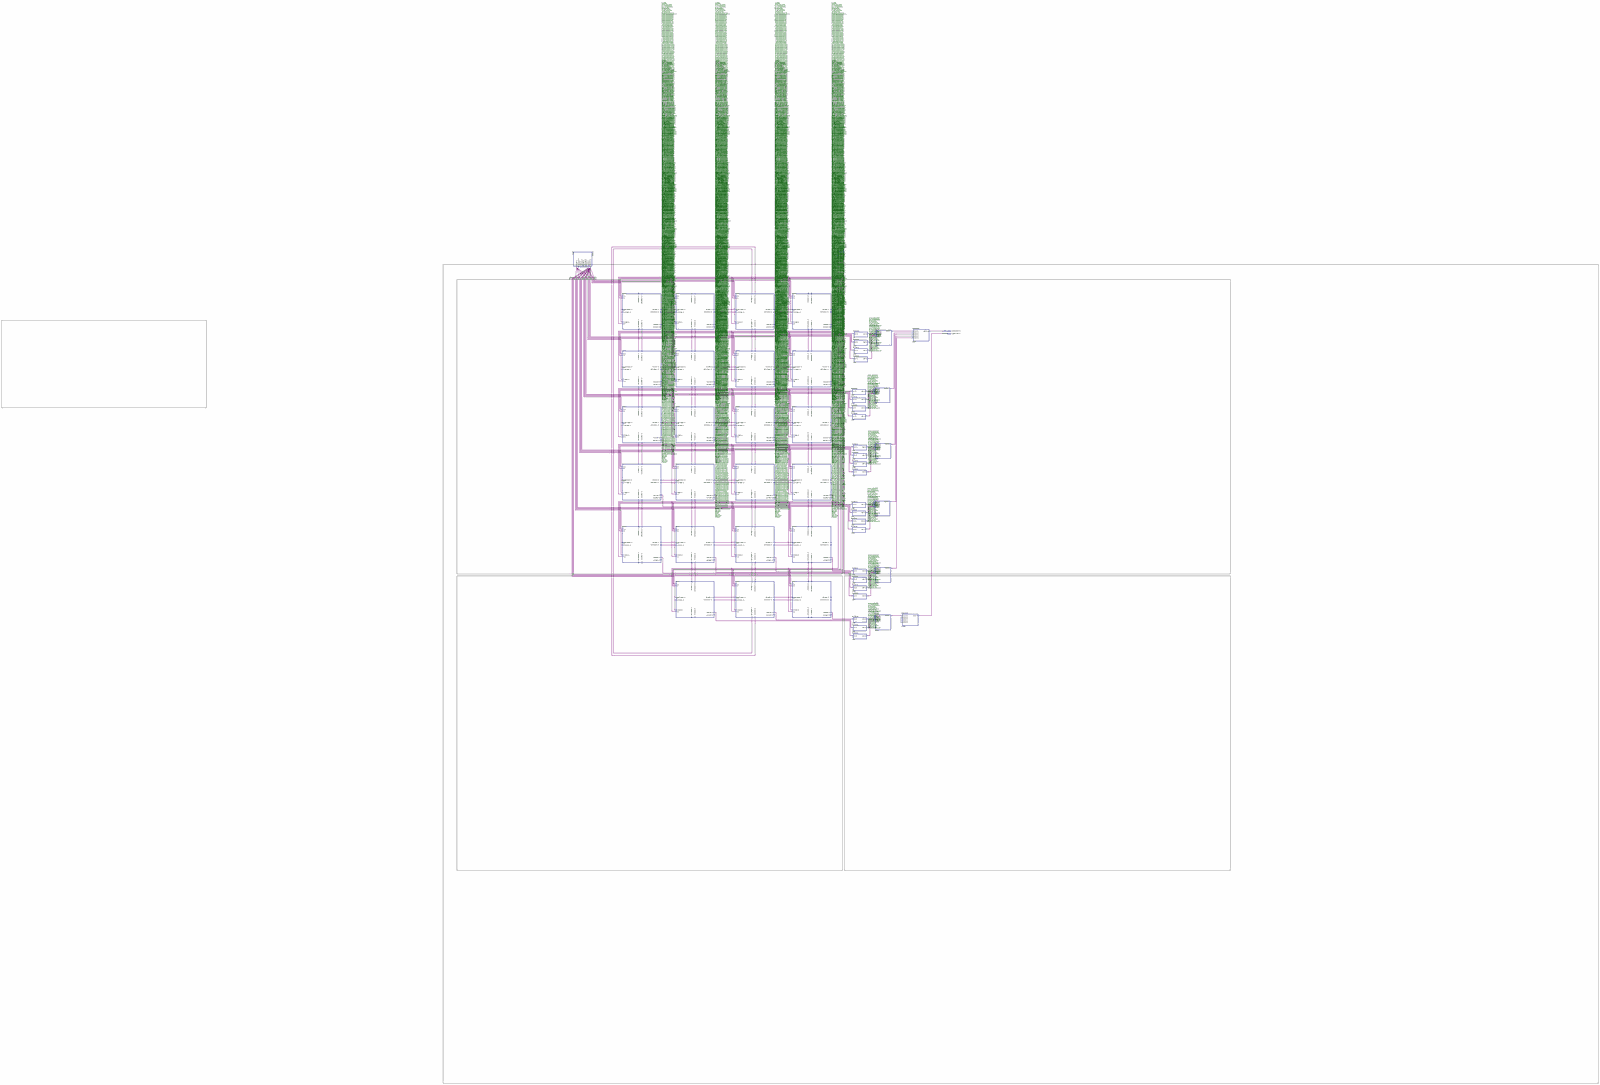
[diagram p0: schematic sheet, whole]
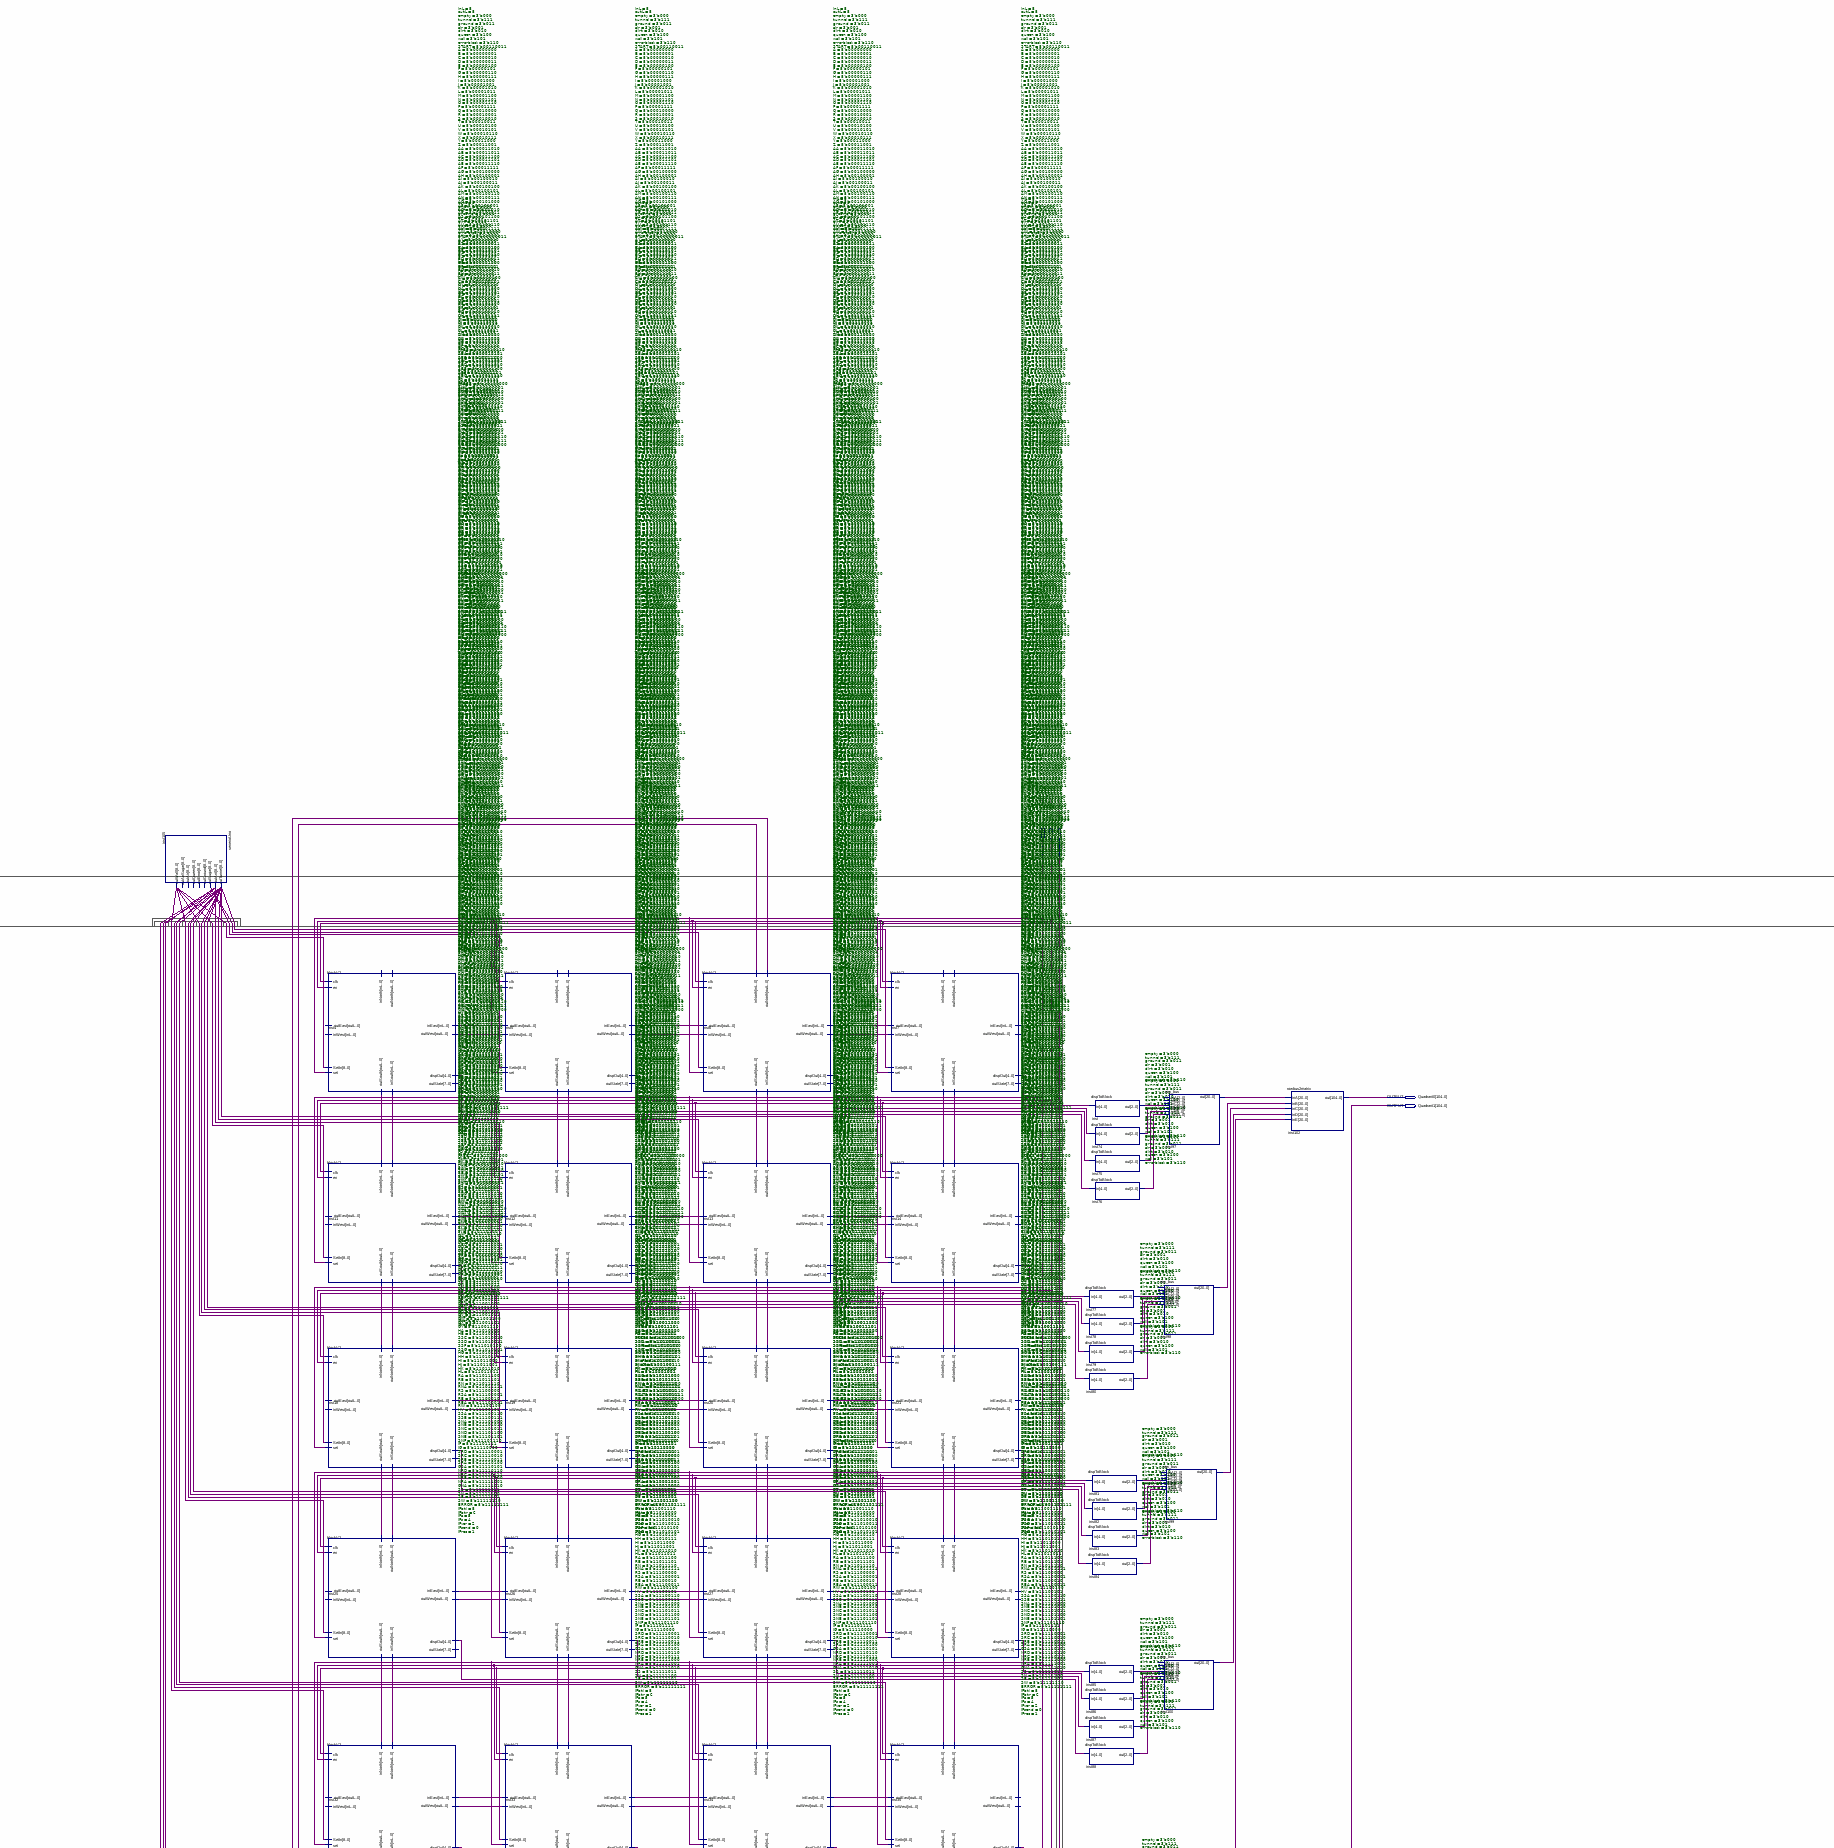
[diagram p1: schematic sheet, upper centre part]
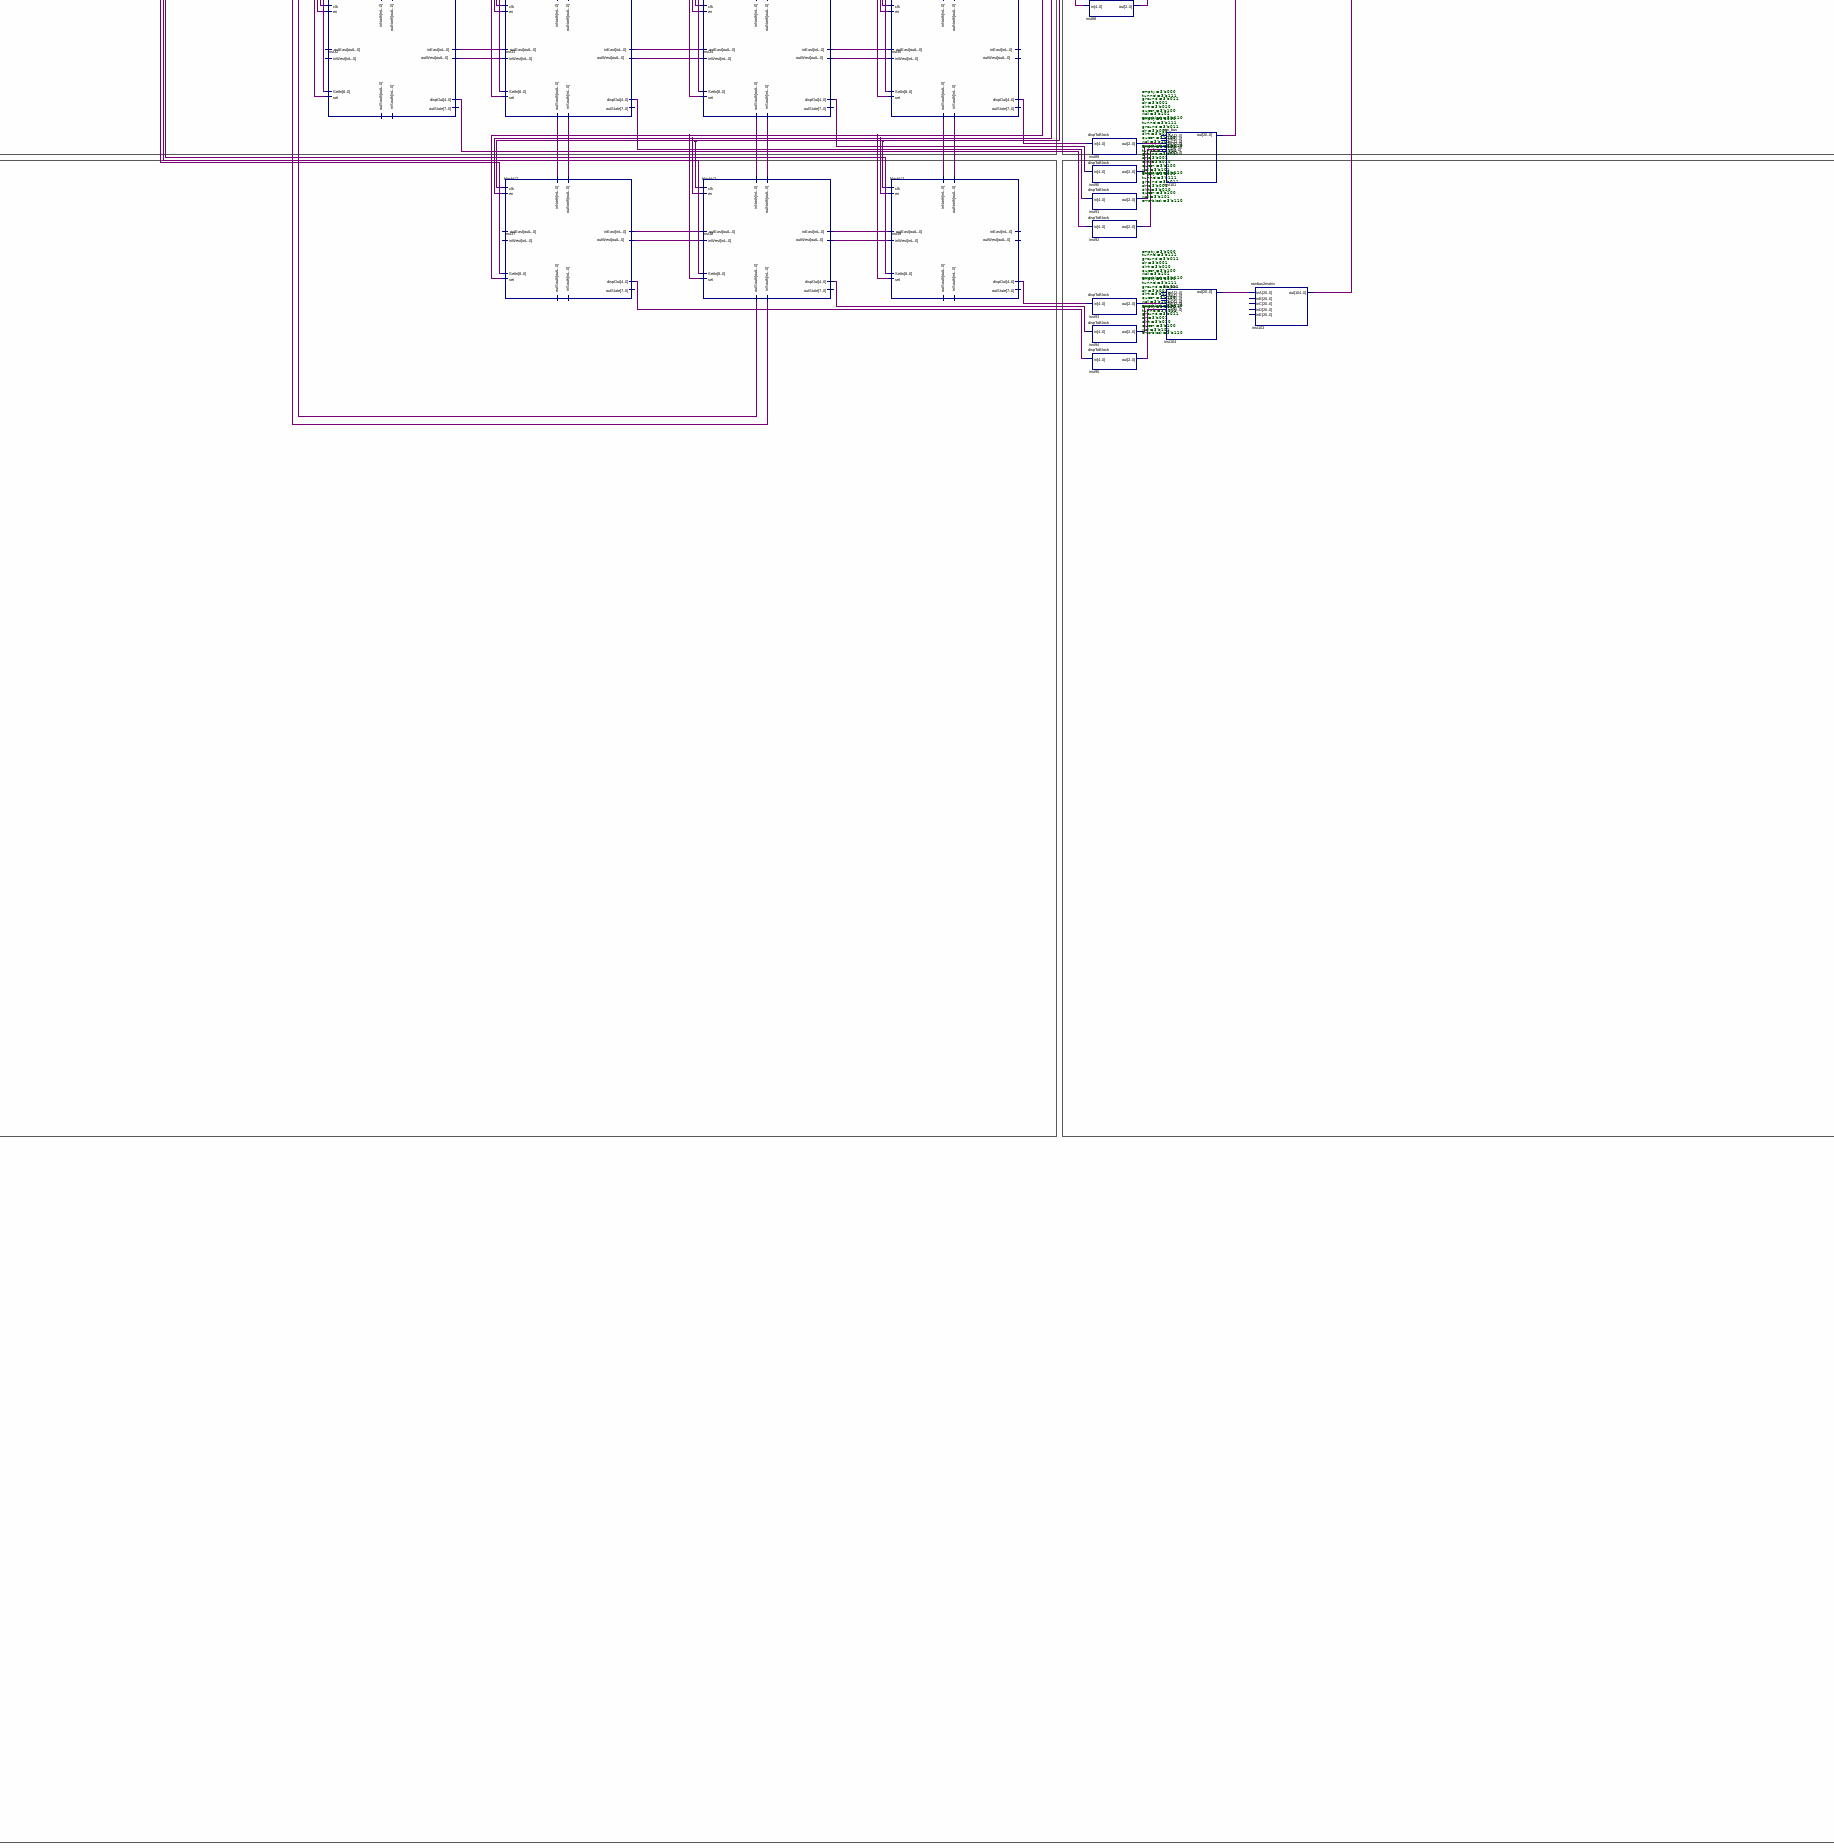
[diagram p2: schematic sheet, lower centre part]
// Quartus schematic EnterTheMAtrix.bdf as structural Verilog: 55 symbols, 5 pins
module EnterTheMAtrix (
  input  set,
  input  enable,
  input  clock_block,
  output [104:0] Quadrant0,
  output [104:0] Quadrant1
);

  wire [2:0] inst74_out, inst75_out, inst76_out, inst77_out, inst78_out, inst79_out, inst80_out, inst81_out,
       inst82_out, inst83_out, inst84_out, inst85_out, inst86_out, inst87_out, inst88_out, inst89_out,
       inst90_out, inst91_out, inst92_out, inst93_out, inst94_out, inst95_out, inst_out;
  wire [4:0] inst4_dispout, inst5_dispout, inst6_dispout, inst7_dispout, inst11_dispout, inst12_dispout,
       inst13_dispout, inst14_dispout, inst18_dispout, inst19_dispout, inst20_dispout, inst21_dispout,
       inst25_dispout, inst26_dispout, inst27_dispout, inst28_dispout, inst32_dispout, inst33_dispout,
       inst34_dispout, inst35_dispout, inst37_dispout, inst38_dispout, inst39_dispout;
  wire [8:0] inst4_outsouth, inst4_outwest, inst5_outeast, inst5_outsouth, inst5_outwest, inst6_outeast,
       inst6_outnorth, inst6_outsouth, inst6_outwest, inst7_outeast, inst7_outsouth, inst11_outnorth,
       inst11_outsouth, inst11_outwest, inst12_outeast, inst12_outnorth, inst12_outsouth, inst12_outwest,
       inst13_outeast, inst13_outnorth, inst13_outsouth, inst13_outwest, inst14_outeast, inst14_outnorth,
       inst14_outsouth, inst18_outnorth, inst18_outsouth, inst18_outwest, inst19_outeast, inst19_outnorth,
       inst19_outsouth, inst19_outwest, inst20_outeast, inst20_outnorth, inst20_outsouth, inst20_outwest,
       inst21_outeast, inst21_outnorth, inst21_outsouth, inst25_outnorth, inst25_outsouth, inst25_outwest,
       inst26_outeast, inst26_outnorth, inst26_outsouth, inst26_outwest, inst27_outeast, inst27_outnorth,
       inst27_outsouth, inst27_outwest, inst28_outeast, inst28_outnorth, inst28_outsouth, inst32_outnorth,
       inst32_outwest, inst33_outeast, inst33_outnorth, inst33_outsouth, inst33_outwest, inst34_outeast,
       inst34_outnorth, inst34_outsouth, inst34_outwest, inst35_outeast, inst35_outnorth, inst35_outsouth,
       inst37_outnorth, inst37_outwest, inst38_outeast, inst38_outnorth, inst38_outsouth, inst38_outwest,
       inst39_outeast, inst39_outnorth, inst105_outant, inst105_outsugar, inst105_outtunnel, inst105_outwall;
  wire [20:0] inst97_out, inst98_out, inst99_out, inst100_out, inst101_out, inst104_out;

  senerioUno inst105 (
    .outTunnel(inst105_outtunnel), .outAnt(inst105_outant), .outSugar(inst105_outsugar),
    .outWall(inst105_outwall));  // open: outGround, outError, outQueen, outAir, outAirSugar
  blockV2 #(.inL(8), .outL(8), .empty(3'b000), .tunnel(3'b111), .ground(3'b011), .air(3'b001), .dirt(3'b010), .queen(3'b100), .wall(3'b101), .errorblock(3'b110), .START(8'b00110011), .A(8'b00000000), .B(8'b00000001), .C(8'b00000010), .D(8'b00000011), .E(8'b00000100), .F(8'b00000101), .G(8'b00000110), .H(8'b00000111), .I(8'b00001000), .J(8'b00001001), .K(8'b00001010), .L(8'b00001011), .M(8'b00001100), .N(8'b00001101), .O(8'b00001110), .P(8'b00001111), .Q(8'b00010000), .R(8'b00010001), .S(8'b00010010), .T(8'b00010011), .U(8'b00010100), .V(8'b00010101), .W(8'b00010110), .X(8'b00010111), .Y(8'b00011000), .Z(8'b00011001), .AA(8'b00011010), .AB(8'b00011011), .AC(8'b00011100), .AD(8'b00011101), .AE(8'b00011110), .AF(8'b00011111), .AG(8'b00100000), .AH(8'b00100001), .AI(8'b00100010), .AJ(8'b00100011), .AK(8'b00100100), .AL(8'b00100101), .AM(8'b00100110), .AN(8'b00100111), .AO(8'b00101000), .AP(8'b00101001), .AQ(8'b00101010), .AR(8'b00101011), .AS(8'b00101100), .AT(8'b00101101), .AU(8'b00101110), .AV(8'b00101111), .AW(8'b00110000), .AX(8'b00110001), .AY(8'b00110010), .AZ(8'b00110011), .BA(8'b00110100), .BB(8'b00110101), .BC(8'b00110110), .BD(8'b00110111), .BE(8'b00111000), .BF(8'b00111001), .BG(8'b00111010), .BH(8'b00111011), .CW(8'b01100100), .CX(8'b01100101), .CY(8'b01100110), .DA(8'b01101000), .DB(8'b01101001), .DC(8'b01101010), .DD(8'b01101011), .DE(8'b01101100), .DF(8'b01101101), .DG(8'b01101110), .DH(8'b01101111), .DI(8'b01110000), .DJ(8'b01110001), .DK(8'b01110010), .DL(8'b01110011), .DM(8'b01110100), .DN(8'b01110101), .DO(8'b01110110), .DP(8'b01110111), .FREE(8'b10010110), .SEA(8'b10010111), .SEB(8'b10011000), .SEC(8'b10011001), .SED(8'b10011010), .SEE(8'b10011100), .SEF(8'b10011101), .SEG(8'b10011110), .FD(8'b10011111), .FREE2(8'b10100000), .SWA(8'b10100001), .SWB(8'b10100010), .SWC(8'b10100011), .SWD(8'b10100100), .SWE(8'b10100101), .SWF(8'b10100110), .SWG(8'b10100111), .FM(8'b10101000), .FN(8'b10101001), .SNG(8'b10101010), .SSE(8'b10101011), .RWA(8'b10101100), .WAIT(8'b10101101), .WAIT2(8'b10101110), .WAIT3(8'b10101111), .WAIT4(8'b10110000), .FV(8'b10110001), .FW(8'b10110010), .FX(8'b10110011), .FY(8'b10110100), .GA(8'b10110110), .GB(8'b10110111), .GC(8'b10111000), .GD(8'b10111001), .GE(8'b10111010), .GF(8'b10111011), .GG(8'b10111100), .GH(8'b10111101), .GI(8'b10111110), .GJ(8'b10111111), .GK(8'b11000000), .GL(8'b11000001), .GM(8'b11000010), .GN(8'b11000011), .GO(8'b11000100), .GP(8'b11000101), .GQ(8'b11000110), .GR(8'b11000111), .GS(8'b11001000), .GT(8'b11001001), .GU(8'b11001010), .GV(8'b11001011), .GW(8'b11001100), .GX(8'b11001101), .GY(8'b11001110), .HA(8'b11010000), .HB(8'b11010001), .SSC(8'b11010010), .SSD(8'b11010011), .SSF(8'b11010100), .SSG(8'b11010101), .HG(8'b11010110), .HH(8'b11010111), .HI(8'b11011000), .HJ(8'b11011001), .HK(8'b11011010), .HL(8'b11011011), .RA(8'b11011100), .RB(8'b11011101), .RN(8'b11011110), .RNA(8'b11011111), .RS(8'b11100000), .RSA(8'b11100001), .RE(8'b11100010), .REA(8'b11100011), .RW(8'b11100100), .HV(8'b11100101), .SSA(8'b11100110), .SSB(8'b11100111), .SNA(8'b11101000), .SNB(8'b11101010), .SNC(8'b11101011), .SND(8'b11101100), .SNE(8'b11101101), .SNF(8'b11101110), .IF(8'b11101111), .IG(8'b11110000), .SRD(8'b11110001), .SRC(8'b11110010), .SRB(8'b11110011), .SRA(8'b11110100), .GSA(8'b11110101), .NRD(8'b11110110), .NRC(8'b11110111), .NRB(8'b11111000), .NRA(8'b11111001), .GNA(8'b11111010), .SS(8'b11111011), .SN(8'b11111100), .SE(8'b11111101), .SW(8'b11111110), .ERROR(8'b11111111), .IPbtl(8), .IPbtr(6), .IPa(5), .IPs(4), .IPver(2), .IPsend(0), .IPrec(1)) inst4 (
    .clk(clock_block), .en(enable), .set(set), .SetIn(inst105_outwall), .inSouth(inst11_outnorth),
    .inEast(inst5_outeast), .outSouth(inst4_outsouth), .outWest(inst4_outwest), .dispOut(inst4_dispout));  // open: inNorth, inWest, outNorth, outEast, outState
  blockV2 #(.inL(8), .outL(8), .empty(3'b000), .tunnel(3'b111), .ground(3'b011), .air(3'b001), .dirt(3'b010), .queen(3'b100), .wall(3'b101), .errorblock(3'b110), .START(8'b00110011), .A(8'b00000000), .B(8'b00000001), .C(8'b00000010), .D(8'b00000011), .E(8'b00000100), .F(8'b00000101), .G(8'b00000110), .H(8'b00000111), .I(8'b00001000), .J(8'b00001001), .K(8'b00001010), .L(8'b00001011), .M(8'b00001100), .N(8'b00001101), .O(8'b00001110), .P(8'b00001111), .Q(8'b00010000), .R(8'b00010001), .S(8'b00010010), .T(8'b00010011), .U(8'b00010100), .V(8'b00010101), .W(8'b00010110), .X(8'b00010111), .Y(8'b00011000), .Z(8'b00011001), .AA(8'b00011010), .AB(8'b00011011), .AC(8'b00011100), .AD(8'b00011101), .AE(8'b00011110), .AF(8'b00011111), .AG(8'b00100000), .AH(8'b00100001), .AI(8'b00100010), .AJ(8'b00100011), .AK(8'b00100100), .AL(8'b00100101), .AM(8'b00100110), .AN(8'b00100111), .AO(8'b00101000), .AP(8'b00101001), .AQ(8'b00101010), .AR(8'b00101011), .AS(8'b00101100), .AT(8'b00101101), .AU(8'b00101110), .AV(8'b00101111), .AW(8'b00110000), .AX(8'b00110001), .AY(8'b00110010), .AZ(8'b00110011), .BA(8'b00110100), .BB(8'b00110101), .BC(8'b00110110), .BD(8'b00110111), .BE(8'b00111000), .BF(8'b00111001), .BG(8'b00111010), .BH(8'b00111011), .CW(8'b01100100), .CX(8'b01100101), .CY(8'b01100110), .DA(8'b01101000), .DB(8'b01101001), .DC(8'b01101010), .DD(8'b01101011), .DE(8'b01101100), .DF(8'b01101101), .DG(8'b01101110), .DH(8'b01101111), .DI(8'b01110000), .DJ(8'b01110001), .DK(8'b01110010), .DL(8'b01110011), .DM(8'b01110100), .DN(8'b01110101), .DO(8'b01110110), .DP(8'b01110111), .FREE(8'b10010110), .SEA(8'b10010111), .SEB(8'b10011000), .SEC(8'b10011001), .SED(8'b10011010), .SEE(8'b10011100), .SEF(8'b10011101), .SEG(8'b10011110), .FD(8'b10011111), .FREE2(8'b10100000), .SWA(8'b10100001), .SWB(8'b10100010), .SWC(8'b10100011), .SWD(8'b10100100), .SWE(8'b10100101), .SWF(8'b10100110), .SWG(8'b10100111), .FM(8'b10101000), .FN(8'b10101001), .SNG(8'b10101010), .SSE(8'b10101011), .RWA(8'b10101100), .WAIT(8'b10101101), .WAIT2(8'b10101110), .WAIT3(8'b10101111), .WAIT4(8'b10110000), .FV(8'b10110001), .FW(8'b10110010), .FX(8'b10110011), .FY(8'b10110100), .GA(8'b10110110), .GB(8'b10110111), .GC(8'b10111000), .GD(8'b10111001), .GE(8'b10111010), .GF(8'b10111011), .GG(8'b10111100), .GH(8'b10111101), .GI(8'b10111110), .GJ(8'b10111111), .GK(8'b11000000), .GL(8'b11000001), .GM(8'b11000010), .GN(8'b11000011), .GO(8'b11000100), .GP(8'b11000101), .GQ(8'b11000110), .GR(8'b11000111), .GS(8'b11001000), .GT(8'b11001001), .GU(8'b11001010), .GV(8'b11001011), .GW(8'b11001100), .GX(8'b11001101), .GY(8'b11001110), .HA(8'b11010000), .HB(8'b11010001), .SSC(8'b11010010), .SSD(8'b11010011), .SSF(8'b11010100), .SSG(8'b11010101), .HG(8'b11010110), .HH(8'b11010111), .HI(8'b11011000), .HJ(8'b11011001), .HK(8'b11011010), .HL(8'b11011011), .RA(8'b11011100), .RB(8'b11011101), .RN(8'b11011110), .RNA(8'b11011111), .RS(8'b11100000), .RSA(8'b11100001), .RE(8'b11100010), .REA(8'b11100011), .RW(8'b11100100), .HV(8'b11100101), .SSA(8'b11100110), .SSB(8'b11100111), .SNA(8'b11101000), .SNB(8'b11101010), .SNC(8'b11101011), .SND(8'b11101100), .SNE(8'b11101101), .SNF(8'b11101110), .IF(8'b11101111), .IG(8'b11110000), .SRD(8'b11110001), .SRC(8'b11110010), .SRB(8'b11110011), .SRA(8'b11110100), .GSA(8'b11110101), .NRD(8'b11110110), .NRC(8'b11110111), .NRB(8'b11111000), .NRA(8'b11111001), .GNA(8'b11111010), .SS(8'b11111011), .SN(8'b11111100), .SE(8'b11111101), .SW(8'b11111110), .ERROR(8'b11111111), .IPbtl(8), .IPbtr(6), .IPa(5), .IPs(4), .IPver(2), .IPsend(0), .IPrec(1)) inst11 (
    .clk(clock_block), .en(enable), .set(set), .SetIn(inst105_outwall), .inNorth(inst4_outsouth),
    .inSouth(inst18_outnorth), .inEast(inst12_outeast), .outNorth(inst11_outnorth),
    .outSouth(inst11_outsouth), .outWest(inst11_outwest), .dispOut(inst11_dispout));  // open: inWest, outEast, outState
  blockV2 #(.inL(8), .outL(8), .empty(3'b000), .tunnel(3'b111), .ground(3'b011), .air(3'b001), .dirt(3'b010), .queen(3'b100), .wall(3'b101), .errorblock(3'b110), .START(8'b00110011), .A(8'b00000000), .B(8'b00000001), .C(8'b00000010), .D(8'b00000011), .E(8'b00000100), .F(8'b00000101), .G(8'b00000110), .H(8'b00000111), .I(8'b00001000), .J(8'b00001001), .K(8'b00001010), .L(8'b00001011), .M(8'b00001100), .N(8'b00001101), .O(8'b00001110), .P(8'b00001111), .Q(8'b00010000), .R(8'b00010001), .S(8'b00010010), .T(8'b00010011), .U(8'b00010100), .V(8'b00010101), .W(8'b00010110), .X(8'b00010111), .Y(8'b00011000), .Z(8'b00011001), .AA(8'b00011010), .AB(8'b00011011), .AC(8'b00011100), .AD(8'b00011101), .AE(8'b00011110), .AF(8'b00011111), .AG(8'b00100000), .AH(8'b00100001), .AI(8'b00100010), .AJ(8'b00100011), .AK(8'b00100100), .AL(8'b00100101), .AM(8'b00100110), .AN(8'b00100111), .AO(8'b00101000), .AP(8'b00101001), .AQ(8'b00101010), .AR(8'b00101011), .AS(8'b00101100), .AT(8'b00101101), .AU(8'b00101110), .AV(8'b00101111), .AW(8'b00110000), .AX(8'b00110001), .AY(8'b00110010), .AZ(8'b00110011), .BA(8'b00110100), .BB(8'b00110101), .BC(8'b00110110), .BD(8'b00110111), .BE(8'b00111000), .BF(8'b00111001), .BG(8'b00111010), .BH(8'b00111011), .CW(8'b01100100), .CX(8'b01100101), .CY(8'b01100110), .DA(8'b01101000), .DB(8'b01101001), .DC(8'b01101010), .DD(8'b01101011), .DE(8'b01101100), .DF(8'b01101101), .DG(8'b01101110), .DH(8'b01101111), .DI(8'b01110000), .DJ(8'b01110001), .DK(8'b01110010), .DL(8'b01110011), .DM(8'b01110100), .DN(8'b01110101), .DO(8'b01110110), .DP(8'b01110111), .FREE(8'b10010110), .SEA(8'b10010111), .SEB(8'b10011000), .SEC(8'b10011001), .SED(8'b10011010), .SEE(8'b10011100), .SEF(8'b10011101), .SEG(8'b10011110), .FD(8'b10011111), .FREE2(8'b10100000), .SWA(8'b10100001), .SWB(8'b10100010), .SWC(8'b10100011), .SWD(8'b10100100), .SWE(8'b10100101), .SWF(8'b10100110), .SWG(8'b10100111), .FM(8'b10101000), .FN(8'b10101001), .SNG(8'b10101010), .SSE(8'b10101011), .RWA(8'b10101100), .WAIT(8'b10101101), .WAIT2(8'b10101110), .WAIT3(8'b10101111), .WAIT4(8'b10110000), .FV(8'b10110001), .FW(8'b10110010), .FX(8'b10110011), .FY(8'b10110100), .GA(8'b10110110), .GB(8'b10110111), .GC(8'b10111000), .GD(8'b10111001), .GE(8'b10111010), .GF(8'b10111011), .GG(8'b10111100), .GH(8'b10111101), .GI(8'b10111110), .GJ(8'b10111111), .GK(8'b11000000), .GL(8'b11000001), .GM(8'b11000010), .GN(8'b11000011), .GO(8'b11000100), .GP(8'b11000101), .GQ(8'b11000110), .GR(8'b11000111), .GS(8'b11001000), .GT(8'b11001001), .GU(8'b11001010), .GV(8'b11001011), .GW(8'b11001100), .GX(8'b11001101), .GY(8'b11001110), .HA(8'b11010000), .HB(8'b11010001), .SSC(8'b11010010), .SSD(8'b11010011), .SSF(8'b11010100), .SSG(8'b11010101), .HG(8'b11010110), .HH(8'b11010111), .HI(8'b11011000), .HJ(8'b11011001), .HK(8'b11011010), .HL(8'b11011011), .RA(8'b11011100), .RB(8'b11011101), .RN(8'b11011110), .RNA(8'b11011111), .RS(8'b11100000), .RSA(8'b11100001), .RE(8'b11100010), .REA(8'b11100011), .RW(8'b11100100), .HV(8'b11100101), .SSA(8'b11100110), .SSB(8'b11100111), .SNA(8'b11101000), .SNB(8'b11101010), .SNC(8'b11101011), .SND(8'b11101100), .SNE(8'b11101101), .SNF(8'b11101110), .IF(8'b11101111), .IG(8'b11110000), .SRD(8'b11110001), .SRC(8'b11110010), .SRB(8'b11110011), .SRA(8'b11110100), .GSA(8'b11110101), .NRD(8'b11110110), .NRC(8'b11110111), .NRB(8'b11111000), .NRA(8'b11111001), .GNA(8'b11111010), .SS(8'b11111011), .SN(8'b11111100), .SE(8'b11111101), .SW(8'b11111110), .ERROR(8'b11111111), .IPbtl(8), .IPbtr(6), .IPa(5), .IPs(4), .IPver(2), .IPsend(0), .IPrec(1)) inst18 (
    .clk(clock_block), .en(enable), .set(set), .SetIn(inst105_outwall), .inNorth(inst11_outsouth),
    .inSouth(inst25_outnorth), .inEast(inst19_outeast), .outNorth(inst18_outnorth),
    .outSouth(inst18_outsouth), .outWest(inst18_outwest), .dispOut(inst18_dispout));  // open: inWest, outEast, outState
  blockV2 #(.inL(8), .outL(8), .empty(3'b000), .tunnel(3'b111), .ground(3'b011), .air(3'b001), .dirt(3'b010), .queen(3'b100), .wall(3'b101), .errorblock(3'b110), .START(8'b00110011), .A(8'b00000000), .B(8'b00000001), .C(8'b00000010), .D(8'b00000011), .E(8'b00000100), .F(8'b00000101), .G(8'b00000110), .H(8'b00000111), .I(8'b00001000), .J(8'b00001001), .K(8'b00001010), .L(8'b00001011), .M(8'b00001100), .N(8'b00001101), .O(8'b00001110), .P(8'b00001111), .Q(8'b00010000), .R(8'b00010001), .S(8'b00010010), .T(8'b00010011), .U(8'b00010100), .V(8'b00010101), .W(8'b00010110), .X(8'b00010111), .Y(8'b00011000), .Z(8'b00011001), .AA(8'b00011010), .AB(8'b00011011), .AC(8'b00011100), .AD(8'b00011101), .AE(8'b00011110), .AF(8'b00011111), .AG(8'b00100000), .AH(8'b00100001), .AI(8'b00100010), .AJ(8'b00100011), .AK(8'b00100100), .AL(8'b00100101), .AM(8'b00100110), .AN(8'b00100111), .AO(8'b00101000), .AP(8'b00101001), .AQ(8'b00101010), .AR(8'b00101011), .AS(8'b00101100), .AT(8'b00101101), .AU(8'b00101110), .AV(8'b00101111), .AW(8'b00110000), .AX(8'b00110001), .AY(8'b00110010), .AZ(8'b00110011), .BA(8'b00110100), .BB(8'b00110101), .BC(8'b00110110), .BD(8'b00110111), .BE(8'b00111000), .BF(8'b00111001), .BG(8'b00111010), .BH(8'b00111011), .CW(8'b01100100), .CX(8'b01100101), .CY(8'b01100110), .DA(8'b01101000), .DB(8'b01101001), .DC(8'b01101010), .DD(8'b01101011), .DE(8'b01101100), .DF(8'b01101101), .DG(8'b01101110), .DH(8'b01101111), .DI(8'b01110000), .DJ(8'b01110001), .DK(8'b01110010), .DL(8'b01110011), .DM(8'b01110100), .DN(8'b01110101), .DO(8'b01110110), .DP(8'b01110111), .FREE(8'b10010110), .SEA(8'b10010111), .SEB(8'b10011000), .SEC(8'b10011001), .SED(8'b10011010), .SEE(8'b10011100), .SEF(8'b10011101), .SEG(8'b10011110), .FD(8'b10011111), .FREE2(8'b10100000), .SWA(8'b10100001), .SWB(8'b10100010), .SWC(8'b10100011), .SWD(8'b10100100), .SWE(8'b10100101), .SWF(8'b10100110), .SWG(8'b10100111), .FM(8'b10101000), .FN(8'b10101001), .SNG(8'b10101010), .SSE(8'b10101011), .RWA(8'b10101100), .WAIT(8'b10101101), .WAIT2(8'b10101110), .WAIT3(8'b10101111), .WAIT4(8'b10110000), .FV(8'b10110001), .FW(8'b10110010), .FX(8'b10110011), .FY(8'b10110100), .GA(8'b10110110), .GB(8'b10110111), .GC(8'b10111000), .GD(8'b10111001), .GE(8'b10111010), .GF(8'b10111011), .GG(8'b10111100), .GH(8'b10111101), .GI(8'b10111110), .GJ(8'b10111111), .GK(8'b11000000), .GL(8'b11000001), .GM(8'b11000010), .GN(8'b11000011), .GO(8'b11000100), .GP(8'b11000101), .GQ(8'b11000110), .GR(8'b11000111), .GS(8'b11001000), .GT(8'b11001001), .GU(8'b11001010), .GV(8'b11001011), .GW(8'b11001100), .GX(8'b11001101), .GY(8'b11001110), .HA(8'b11010000), .HB(8'b11010001), .SSC(8'b11010010), .SSD(8'b11010011), .SSF(8'b11010100), .SSG(8'b11010101), .HG(8'b11010110), .HH(8'b11010111), .HI(8'b11011000), .HJ(8'b11011001), .HK(8'b11011010), .HL(8'b11011011), .RA(8'b11011100), .RB(8'b11011101), .RN(8'b11011110), .RNA(8'b11011111), .RS(8'b11100000), .RSA(8'b11100001), .RE(8'b11100010), .REA(8'b11100011), .RW(8'b11100100), .HV(8'b11100101), .SSA(8'b11100110), .SSB(8'b11100111), .SNA(8'b11101000), .SNB(8'b11101010), .SNC(8'b11101011), .SND(8'b11101100), .SNE(8'b11101101), .SNF(8'b11101110), .IF(8'b11101111), .IG(8'b11110000), .SRD(8'b11110001), .SRC(8'b11110010), .SRB(8'b11110011), .SRA(8'b11110100), .GSA(8'b11110101), .NRD(8'b11110110), .NRC(8'b11110111), .NRB(8'b11111000), .NRA(8'b11111001), .GNA(8'b11111010), .SS(8'b11111011), .SN(8'b11111100), .SE(8'b11111101), .SW(8'b11111110), .ERROR(8'b11111111), .IPbtl(8), .IPbtr(6), .IPa(5), .IPs(4), .IPver(2), .IPsend(0), .IPrec(1)) inst25 (
    .clk(clock_block), .en(enable), .set(set), .SetIn(inst105_outwall), .inNorth(inst18_outsouth),
    .inSouth(inst32_outnorth), .inEast(inst26_outeast), .outNorth(inst25_outnorth),
    .outSouth(inst25_outsouth), .outWest(inst25_outwest), .dispOut(inst25_dispout));  // open: inWest, outEast, outState
  blockV2 #(.inL(8), .outL(8), .empty(3'b000), .tunnel(3'b111), .ground(3'b011), .air(3'b001), .dirt(3'b010), .queen(3'b100), .wall(3'b101), .errorblock(3'b110), .START(8'b00110011), .A(8'b00000000), .B(8'b00000001), .C(8'b00000010), .D(8'b00000011), .E(8'b00000100), .F(8'b00000101), .G(8'b00000110), .H(8'b00000111), .I(8'b00001000), .J(8'b00001001), .K(8'b00001010), .L(8'b00001011), .M(8'b00001100), .N(8'b00001101), .O(8'b00001110), .P(8'b00001111), .Q(8'b00010000), .R(8'b00010001), .S(8'b00010010), .T(8'b00010011), .U(8'b00010100), .V(8'b00010101), .W(8'b00010110), .X(8'b00010111), .Y(8'b00011000), .Z(8'b00011001), .AA(8'b00011010), .AB(8'b00011011), .AC(8'b00011100), .AD(8'b00011101), .AE(8'b00011110), .AF(8'b00011111), .AG(8'b00100000), .AH(8'b00100001), .AI(8'b00100010), .AJ(8'b00100011), .AK(8'b00100100), .AL(8'b00100101), .AM(8'b00100110), .AN(8'b00100111), .AO(8'b00101000), .AP(8'b00101001), .AQ(8'b00101010), .AR(8'b00101011), .AS(8'b00101100), .AT(8'b00101101), .AU(8'b00101110), .AV(8'b00101111), .AW(8'b00110000), .AX(8'b00110001), .AY(8'b00110010), .AZ(8'b00110011), .BA(8'b00110100), .BB(8'b00110101), .BC(8'b00110110), .BD(8'b00110111), .BE(8'b00111000), .BF(8'b00111001), .BG(8'b00111010), .BH(8'b00111011), .CW(8'b01100100), .CX(8'b01100101), .CY(8'b01100110), .DA(8'b01101000), .DB(8'b01101001), .DC(8'b01101010), .DD(8'b01101011), .DE(8'b01101100), .DF(8'b01101101), .DG(8'b01101110), .DH(8'b01101111), .DI(8'b01110000), .DJ(8'b01110001), .DK(8'b01110010), .DL(8'b01110011), .DM(8'b01110100), .DN(8'b01110101), .DO(8'b01110110), .DP(8'b01110111), .FREE(8'b10010110), .SEA(8'b10010111), .SEB(8'b10011000), .SEC(8'b10011001), .SED(8'b10011010), .SEE(8'b10011100), .SEF(8'b10011101), .SEG(8'b10011110), .FD(8'b10011111), .FREE2(8'b10100000), .SWA(8'b10100001), .SWB(8'b10100010), .SWC(8'b10100011), .SWD(8'b10100100), .SWE(8'b10100101), .SWF(8'b10100110), .SWG(8'b10100111), .FM(8'b10101000), .FN(8'b10101001), .SNG(8'b10101010), .SSE(8'b10101011), .RWA(8'b10101100), .WAIT(8'b10101101), .WAIT2(8'b10101110), .WAIT3(8'b10101111), .WAIT4(8'b10110000), .FV(8'b10110001), .FW(8'b10110010), .FX(8'b10110011), .FY(8'b10110100), .GA(8'b10110110), .GB(8'b10110111), .GC(8'b10111000), .GD(8'b10111001), .GE(8'b10111010), .GF(8'b10111011), .GG(8'b10111100), .GH(8'b10111101), .GI(8'b10111110), .GJ(8'b10111111), .GK(8'b11000000), .GL(8'b11000001), .GM(8'b11000010), .GN(8'b11000011), .GO(8'b11000100), .GP(8'b11000101), .GQ(8'b11000110), .GR(8'b11000111), .GS(8'b11001000), .GT(8'b11001001), .GU(8'b11001010), .GV(8'b11001011), .GW(8'b11001100), .GX(8'b11001101), .GY(8'b11001110), .HA(8'b11010000), .HB(8'b11010001), .SSC(8'b11010010), .SSD(8'b11010011), .SSF(8'b11010100), .SSG(8'b11010101), .HG(8'b11010110), .HH(8'b11010111), .HI(8'b11011000), .HJ(8'b11011001), .HK(8'b11011010), .HL(8'b11011011), .RA(8'b11011100), .RB(8'b11011101), .RN(8'b11011110), .RNA(8'b11011111), .RS(8'b11100000), .RSA(8'b11100001), .RE(8'b11100010), .REA(8'b11100011), .RW(8'b11100100), .HV(8'b11100101), .SSA(8'b11100110), .SSB(8'b11100111), .SNA(8'b11101000), .SNB(8'b11101010), .SNC(8'b11101011), .SND(8'b11101100), .SNE(8'b11101101), .SNF(8'b11101110), .IF(8'b11101111), .IG(8'b11110000), .SRD(8'b11110001), .SRC(8'b11110010), .SRB(8'b11110011), .SRA(8'b11110100), .GSA(8'b11110101), .NRD(8'b11110110), .NRC(8'b11110111), .NRB(8'b11111000), .NRA(8'b11111001), .GNA(8'b11111010), .SS(8'b11111011), .SN(8'b11111100), .SE(8'b11111101), .SW(8'b11111110), .ERROR(8'b11111111), .IPbtl(8), .IPbtr(6), .IPa(5), .IPs(4), .IPver(2), .IPsend(0), .IPrec(1)) inst32 (
    .clk(clock_block), .en(enable), .set(set), .SetIn(inst105_outwall), .inNorth(inst25_outsouth),
    .inEast(inst33_outeast), .outNorth(inst32_outnorth), .outWest(inst32_outwest), .dispOut(inst32_dispout));  // open: inSouth, inWest, outSouth, outEast, outState
  blockV2 #(.inL(8), .outL(8), .empty(3'b000), .tunnel(3'b111), .ground(3'b011), .air(3'b001), .dirt(3'b010), .queen(3'b100), .wall(3'b101), .errorblock(3'b110), .START(8'b00110011), .A(8'b00000000), .B(8'b00000001), .C(8'b00000010), .D(8'b00000011), .E(8'b00000100), .F(8'b00000101), .G(8'b00000110), .H(8'b00000111), .I(8'b00001000), .J(8'b00001001), .K(8'b00001010), .L(8'b00001011), .M(8'b00001100), .N(8'b00001101), .O(8'b00001110), .P(8'b00001111), .Q(8'b00010000), .R(8'b00010001), .S(8'b00010010), .T(8'b00010011), .U(8'b00010100), .V(8'b00010101), .W(8'b00010110), .X(8'b00010111), .Y(8'b00011000), .Z(8'b00011001), .AA(8'b00011010), .AB(8'b00011011), .AC(8'b00011100), .AD(8'b00011101), .AE(8'b00011110), .AF(8'b00011111), .AG(8'b00100000), .AH(8'b00100001), .AI(8'b00100010), .AJ(8'b00100011), .AK(8'b00100100), .AL(8'b00100101), .AM(8'b00100110), .AN(8'b00100111), .AO(8'b00101000), .AP(8'b00101001), .AQ(8'b00101010), .AR(8'b00101011), .AS(8'b00101100), .AT(8'b00101101), .AU(8'b00101110), .AV(8'b00101111), .AW(8'b00110000), .AX(8'b00110001), .AY(8'b00110010), .AZ(8'b00110011), .BA(8'b00110100), .BB(8'b00110101), .BC(8'b00110110), .BD(8'b00110111), .BE(8'b00111000), .BF(8'b00111001), .BG(8'b00111010), .BH(8'b00111011), .CW(8'b01100100), .CX(8'b01100101), .CY(8'b01100110), .DA(8'b01101000), .DB(8'b01101001), .DC(8'b01101010), .DD(8'b01101011), .DE(8'b01101100), .DF(8'b01101101), .DG(8'b01101110), .DH(8'b01101111), .DI(8'b01110000), .DJ(8'b01110001), .DK(8'b01110010), .DL(8'b01110011), .DM(8'b01110100), .DN(8'b01110101), .DO(8'b01110110), .DP(8'b01110111), .FREE(8'b10010110), .SEA(8'b10010111), .SEB(8'b10011000), .SEC(8'b10011001), .SED(8'b10011010), .SEE(8'b10011100), .SEF(8'b10011101), .SEG(8'b10011110), .FD(8'b10011111), .FREE2(8'b10100000), .SWA(8'b10100001), .SWB(8'b10100010), .SWC(8'b10100011), .SWD(8'b10100100), .SWE(8'b10100101), .SWF(8'b10100110), .SWG(8'b10100111), .FM(8'b10101000), .FN(8'b10101001), .SNG(8'b10101010), .SSE(8'b10101011), .RWA(8'b10101100), .WAIT(8'b10101101), .WAIT2(8'b10101110), .WAIT3(8'b10101111), .WAIT4(8'b10110000), .FV(8'b10110001), .FW(8'b10110010), .FX(8'b10110011), .FY(8'b10110100), .GA(8'b10110110), .GB(8'b10110111), .GC(8'b10111000), .GD(8'b10111001), .GE(8'b10111010), .GF(8'b10111011), .GG(8'b10111100), .GH(8'b10111101), .GI(8'b10111110), .GJ(8'b10111111), .GK(8'b11000000), .GL(8'b11000001), .GM(8'b11000010), .GN(8'b11000011), .GO(8'b11000100), .GP(8'b11000101), .GQ(8'b11000110), .GR(8'b11000111), .GS(8'b11001000), .GT(8'b11001001), .GU(8'b11001010), .GV(8'b11001011), .GW(8'b11001100), .GX(8'b11001101), .GY(8'b11001110), .HA(8'b11010000), .HB(8'b11010001), .SSC(8'b11010010), .SSD(8'b11010011), .SSF(8'b11010100), .SSG(8'b11010101), .HG(8'b11010110), .HH(8'b11010111), .HI(8'b11011000), .HJ(8'b11011001), .HK(8'b11011010), .HL(8'b11011011), .RA(8'b11011100), .RB(8'b11011101), .RN(8'b11011110), .RNA(8'b11011111), .RS(8'b11100000), .RSA(8'b11100001), .RE(8'b11100010), .REA(8'b11100011), .RW(8'b11100100), .HV(8'b11100101), .SSA(8'b11100110), .SSB(8'b11100111), .SNA(8'b11101000), .SNB(8'b11101010), .SNC(8'b11101011), .SND(8'b11101100), .SNE(8'b11101101), .SNF(8'b11101110), .IF(8'b11101111), .IG(8'b11110000), .SRD(8'b11110001), .SRC(8'b11110010), .SRB(8'b11110011), .SRA(8'b11110100), .GSA(8'b11110101), .NRD(8'b11110110), .NRC(8'b11110111), .NRB(8'b11111000), .NRA(8'b11111001), .GNA(8'b11111010), .SS(8'b11111011), .SN(8'b11111100), .SE(8'b11111101), .SW(8'b11111110), .ERROR(8'b11111111), .IPbtl(8), .IPbtr(6), .IPa(5), .IPs(4), .IPver(2), .IPsend(0), .IPrec(1)) inst5 (
    .clk(clock_block), .en(enable), .set(set), .SetIn(inst105_outsugar), .inSouth(inst12_outnorth),
    .inEast(inst6_outeast), .inWest(inst4_outwest), .outSouth(inst5_outsouth), .outEast(inst5_outeast),
    .outWest(inst5_outwest), .dispOut(inst5_dispout));  // open: inNorth, outNorth, outState
  blockV2 #(.inL(8), .outL(8), .empty(3'b000), .tunnel(3'b111), .ground(3'b011), .air(3'b001), .dirt(3'b010), .queen(3'b100), .wall(3'b101), .errorblock(3'b110), .START(8'b00110011), .A(8'b00000000), .B(8'b00000001), .C(8'b00000010), .D(8'b00000011), .E(8'b00000100), .F(8'b00000101), .G(8'b00000110), .H(8'b00000111), .I(8'b00001000), .J(8'b00001001), .K(8'b00001010), .L(8'b00001011), .M(8'b00001100), .N(8'b00001101), .O(8'b00001110), .P(8'b00001111), .Q(8'b00010000), .R(8'b00010001), .S(8'b00010010), .T(8'b00010011), .U(8'b00010100), .V(8'b00010101), .W(8'b00010110), .X(8'b00010111), .Y(8'b00011000), .Z(8'b00011001), .AA(8'b00011010), .AB(8'b00011011), .AC(8'b00011100), .AD(8'b00011101), .AE(8'b00011110), .AF(8'b00011111), .AG(8'b00100000), .AH(8'b00100001), .AI(8'b00100010), .AJ(8'b00100011), .AK(8'b00100100), .AL(8'b00100101), .AM(8'b00100110), .AN(8'b00100111), .AO(8'b00101000), .AP(8'b00101001), .AQ(8'b00101010), .AR(8'b00101011), .AS(8'b00101100), .AT(8'b00101101), .AU(8'b00101110), .AV(8'b00101111), .AW(8'b00110000), .AX(8'b00110001), .AY(8'b00110010), .AZ(8'b00110011), .BA(8'b00110100), .BB(8'b00110101), .BC(8'b00110110), .BD(8'b00110111), .BE(8'b00111000), .BF(8'b00111001), .BG(8'b00111010), .BH(8'b00111011), .CW(8'b01100100), .CX(8'b01100101), .CY(8'b01100110), .DA(8'b01101000), .DB(8'b01101001), .DC(8'b01101010), .DD(8'b01101011), .DE(8'b01101100), .DF(8'b01101101), .DG(8'b01101110), .DH(8'b01101111), .DI(8'b01110000), .DJ(8'b01110001), .DK(8'b01110010), .DL(8'b01110011), .DM(8'b01110100), .DN(8'b01110101), .DO(8'b01110110), .DP(8'b01110111), .FREE(8'b10010110), .SEA(8'b10010111), .SEB(8'b10011000), .SEC(8'b10011001), .SED(8'b10011010), .SEE(8'b10011100), .SEF(8'b10011101), .SEG(8'b10011110), .FD(8'b10011111), .FREE2(8'b10100000), .SWA(8'b10100001), .SWB(8'b10100010), .SWC(8'b10100011), .SWD(8'b10100100), .SWE(8'b10100101), .SWF(8'b10100110), .SWG(8'b10100111), .FM(8'b10101000), .FN(8'b10101001), .SNG(8'b10101010), .SSE(8'b10101011), .RWA(8'b10101100), .WAIT(8'b10101101), .WAIT2(8'b10101110), .WAIT3(8'b10101111), .WAIT4(8'b10110000), .FV(8'b10110001), .FW(8'b10110010), .FX(8'b10110011), .FY(8'b10110100), .GA(8'b10110110), .GB(8'b10110111), .GC(8'b10111000), .GD(8'b10111001), .GE(8'b10111010), .GF(8'b10111011), .GG(8'b10111100), .GH(8'b10111101), .GI(8'b10111110), .GJ(8'b10111111), .GK(8'b11000000), .GL(8'b11000001), .GM(8'b11000010), .GN(8'b11000011), .GO(8'b11000100), .GP(8'b11000101), .GQ(8'b11000110), .GR(8'b11000111), .GS(8'b11001000), .GT(8'b11001001), .GU(8'b11001010), .GV(8'b11001011), .GW(8'b11001100), .GX(8'b11001101), .GY(8'b11001110), .HA(8'b11010000), .HB(8'b11010001), .SSC(8'b11010010), .SSD(8'b11010011), .SSF(8'b11010100), .SSG(8'b11010101), .HG(8'b11010110), .HH(8'b11010111), .HI(8'b11011000), .HJ(8'b11011001), .HK(8'b11011010), .HL(8'b11011011), .RA(8'b11011100), .RB(8'b11011101), .RN(8'b11011110), .RNA(8'b11011111), .RS(8'b11100000), .RSA(8'b11100001), .RE(8'b11100010), .REA(8'b11100011), .RW(8'b11100100), .HV(8'b11100101), .SSA(8'b11100110), .SSB(8'b11100111), .SNA(8'b11101000), .SNB(8'b11101010), .SNC(8'b11101011), .SND(8'b11101100), .SNE(8'b11101101), .SNF(8'b11101110), .IF(8'b11101111), .IG(8'b11110000), .SRD(8'b11110001), .SRC(8'b11110010), .SRB(8'b11110011), .SRA(8'b11110100), .GSA(8'b11110101), .NRD(8'b11110110), .NRC(8'b11110111), .NRB(8'b11111000), .NRA(8'b11111001), .GNA(8'b11111010), .SS(8'b11111011), .SN(8'b11111100), .SE(8'b11111101), .SW(8'b11111110), .ERROR(8'b11111111), .IPbtl(8), .IPbtr(6), .IPa(5), .IPs(4), .IPver(2), .IPsend(0), .IPrec(1)) inst12 (
    .clk(clock_block), .en(enable), .set(set), .SetIn(inst105_outant), .inNorth(inst5_outsouth),
    .inSouth(inst19_outnorth), .inEast(inst13_outeast), .inWest(inst11_outwest), .outNorth(inst12_outnorth),
    .outSouth(inst12_outsouth), .outEast(inst12_outeast), .outWest(inst12_outwest), .dispOut(inst12_dispout));  // open: outState
  blockV2 #(.inL(8), .outL(8), .empty(3'b000), .tunnel(3'b111), .ground(3'b011), .air(3'b001), .dirt(3'b010), .queen(3'b100), .wall(3'b101), .errorblock(3'b110), .START(8'b00110011), .A(8'b00000000), .B(8'b00000001), .C(8'b00000010), .D(8'b00000011), .E(8'b00000100), .F(8'b00000101), .G(8'b00000110), .H(8'b00000111), .I(8'b00001000), .J(8'b00001001), .K(8'b00001010), .L(8'b00001011), .M(8'b00001100), .N(8'b00001101), .O(8'b00001110), .P(8'b00001111), .Q(8'b00010000), .R(8'b00010001), .S(8'b00010010), .T(8'b00010011), .U(8'b00010100), .V(8'b00010101), .W(8'b00010110), .X(8'b00010111), .Y(8'b00011000), .Z(8'b00011001), .AA(8'b00011010), .AB(8'b00011011), .AC(8'b00011100), .AD(8'b00011101), .AE(8'b00011110), .AF(8'b00011111), .AG(8'b00100000), .AH(8'b00100001), .AI(8'b00100010), .AJ(8'b00100011), .AK(8'b00100100), .AL(8'b00100101), .AM(8'b00100110), .AN(8'b00100111), .AO(8'b00101000), .AP(8'b00101001), .AQ(8'b00101010), .AR(8'b00101011), .AS(8'b00101100), .AT(8'b00101101), .AU(8'b00101110), .AV(8'b00101111), .AW(8'b00110000), .AX(8'b00110001), .AY(8'b00110010), .AZ(8'b00110011), .BA(8'b00110100), .BB(8'b00110101), .BC(8'b00110110), .BD(8'b00110111), .BE(8'b00111000), .BF(8'b00111001), .BG(8'b00111010), .BH(8'b00111011), .CW(8'b01100100), .CX(8'b01100101), .CY(8'b01100110), .DA(8'b01101000), .DB(8'b01101001), .DC(8'b01101010), .DD(8'b01101011), .DE(8'b01101100), .DF(8'b01101101), .DG(8'b01101110), .DH(8'b01101111), .DI(8'b01110000), .DJ(8'b01110001), .DK(8'b01110010), .DL(8'b01110011), .DM(8'b01110100), .DN(8'b01110101), .DO(8'b01110110), .DP(8'b01110111), .FREE(8'b10010110), .SEA(8'b10010111), .SEB(8'b10011000), .SEC(8'b10011001), .SED(8'b10011010), .SEE(8'b10011100), .SEF(8'b10011101), .SEG(8'b10011110), .FD(8'b10011111), .FREE2(8'b10100000), .SWA(8'b10100001), .SWB(8'b10100010), .SWC(8'b10100011), .SWD(8'b10100100), .SWE(8'b10100101), .SWF(8'b10100110), .SWG(8'b10100111), .FM(8'b10101000), .FN(8'b10101001), .SNG(8'b10101010), .SSE(8'b10101011), .RWA(8'b10101100), .WAIT(8'b10101101), .WAIT2(8'b10101110), .WAIT3(8'b10101111), .WAIT4(8'b10110000), .FV(8'b10110001), .FW(8'b10110010), .FX(8'b10110011), .FY(8'b10110100), .GA(8'b10110110), .GB(8'b10110111), .GC(8'b10111000), .GD(8'b10111001), .GE(8'b10111010), .GF(8'b10111011), .GG(8'b10111100), .GH(8'b10111101), .GI(8'b10111110), .GJ(8'b10111111), .GK(8'b11000000), .GL(8'b11000001), .GM(8'b11000010), .GN(8'b11000011), .GO(8'b11000100), .GP(8'b11000101), .GQ(8'b11000110), .GR(8'b11000111), .GS(8'b11001000), .GT(8'b11001001), .GU(8'b11001010), .GV(8'b11001011), .GW(8'b11001100), .GX(8'b11001101), .GY(8'b11001110), .HA(8'b11010000), .HB(8'b11010001), .SSC(8'b11010010), .SSD(8'b11010011), .SSF(8'b11010100), .SSG(8'b11010101), .HG(8'b11010110), .HH(8'b11010111), .HI(8'b11011000), .HJ(8'b11011001), .HK(8'b11011010), .HL(8'b11011011), .RA(8'b11011100), .RB(8'b11011101), .RN(8'b11011110), .RNA(8'b11011111), .RS(8'b11100000), .RSA(8'b11100001), .RE(8'b11100010), .REA(8'b11100011), .RW(8'b11100100), .HV(8'b11100101), .SSA(8'b11100110), .SSB(8'b11100111), .SNA(8'b11101000), .SNB(8'b11101010), .SNC(8'b11101011), .SND(8'b11101100), .SNE(8'b11101101), .SNF(8'b11101110), .IF(8'b11101111), .IG(8'b11110000), .SRD(8'b11110001), .SRC(8'b11110010), .SRB(8'b11110011), .SRA(8'b11110100), .GSA(8'b11110101), .NRD(8'b11110110), .NRC(8'b11110111), .NRB(8'b11111000), .NRA(8'b11111001), .GNA(8'b11111010), .SS(8'b11111011), .SN(8'b11111100), .SE(8'b11111101), .SW(8'b11111110), .ERROR(8'b11111111), .IPbtl(8), .IPbtr(6), .IPa(5), .IPs(4), .IPver(2), .IPsend(0), .IPrec(1)) inst19 (
    .clk(clock_block), .en(enable), .set(set), .SetIn(inst105_outtunnel), .inNorth(inst12_outsouth),
    .inSouth(inst26_outnorth), .inEast(inst20_outeast), .inWest(inst18_outwest), .outNorth(inst19_outnorth),
    .outSouth(inst19_outsouth), .outEast(inst19_outeast), .outWest(inst19_outwest), .dispOut(inst19_dispout));  // open: outState
  blockV2 #(.inL(8), .outL(8), .empty(3'b000), .tunnel(3'b111), .ground(3'b011), .air(3'b001), .dirt(3'b010), .queen(3'b100), .wall(3'b101), .errorblock(3'b110), .START(8'b00110011), .A(8'b00000000), .B(8'b00000001), .C(8'b00000010), .D(8'b00000011), .E(8'b00000100), .F(8'b00000101), .G(8'b00000110), .H(8'b00000111), .I(8'b00001000), .J(8'b00001001), .K(8'b00001010), .L(8'b00001011), .M(8'b00001100), .N(8'b00001101), .O(8'b00001110), .P(8'b00001111), .Q(8'b00010000), .R(8'b00010001), .S(8'b00010010), .T(8'b00010011), .U(8'b00010100), .V(8'b00010101), .W(8'b00010110), .X(8'b00010111), .Y(8'b00011000), .Z(8'b00011001), .AA(8'b00011010), .AB(8'b00011011), .AC(8'b00011100), .AD(8'b00011101), .AE(8'b00011110), .AF(8'b00011111), .AG(8'b00100000), .AH(8'b00100001), .AI(8'b00100010), .AJ(8'b00100011), .AK(8'b00100100), .AL(8'b00100101), .AM(8'b00100110), .AN(8'b00100111), .AO(8'b00101000), .AP(8'b00101001), .AQ(8'b00101010), .AR(8'b00101011), .AS(8'b00101100), .AT(8'b00101101), .AU(8'b00101110), .AV(8'b00101111), .AW(8'b00110000), .AX(8'b00110001), .AY(8'b00110010), .AZ(8'b00110011), .BA(8'b00110100), .BB(8'b00110101), .BC(8'b00110110), .BD(8'b00110111), .BE(8'b00111000), .BF(8'b00111001), .BG(8'b00111010), .BH(8'b00111011), .CW(8'b01100100), .CX(8'b01100101), .CY(8'b01100110), .DA(8'b01101000), .DB(8'b01101001), .DC(8'b01101010), .DD(8'b01101011), .DE(8'b01101100), .DF(8'b01101101), .DG(8'b01101110), .DH(8'b01101111), .DI(8'b01110000), .DJ(8'b01110001), .DK(8'b01110010), .DL(8'b01110011), .DM(8'b01110100), .DN(8'b01110101), .DO(8'b01110110), .DP(8'b01110111), .FREE(8'b10010110), .SEA(8'b10010111), .SEB(8'b10011000), .SEC(8'b10011001), .SED(8'b10011010), .SEE(8'b10011100), .SEF(8'b10011101), .SEG(8'b10011110), .FD(8'b10011111), .FREE2(8'b10100000), .SWA(8'b10100001), .SWB(8'b10100010), .SWC(8'b10100011), .SWD(8'b10100100), .SWE(8'b10100101), .SWF(8'b10100110), .SWG(8'b10100111), .FM(8'b10101000), .FN(8'b10101001), .SNG(8'b10101010), .SSE(8'b10101011), .RWA(8'b10101100), .WAIT(8'b10101101), .WAIT2(8'b10101110), .WAIT3(8'b10101111), .WAIT4(8'b10110000), .FV(8'b10110001), .FW(8'b10110010), .FX(8'b10110011), .FY(8'b10110100), .GA(8'b10110110), .GB(8'b10110111), .GC(8'b10111000), .GD(8'b10111001), .GE(8'b10111010), .GF(8'b10111011), .GG(8'b10111100), .GH(8'b10111101), .GI(8'b10111110), .GJ(8'b10111111), .GK(8'b11000000), .GL(8'b11000001), .GM(8'b11000010), .GN(8'b11000011), .GO(8'b11000100), .GP(8'b11000101), .GQ(8'b11000110), .GR(8'b11000111), .GS(8'b11001000), .GT(8'b11001001), .GU(8'b11001010), .GV(8'b11001011), .GW(8'b11001100), .GX(8'b11001101), .GY(8'b11001110), .HA(8'b11010000), .HB(8'b11010001), .SSC(8'b11010010), .SSD(8'b11010011), .SSF(8'b11010100), .SSG(8'b11010101), .HG(8'b11010110), .HH(8'b11010111), .HI(8'b11011000), .HJ(8'b11011001), .HK(8'b11011010), .HL(8'b11011011), .RA(8'b11011100), .RB(8'b11011101), .RN(8'b11011110), .RNA(8'b11011111), .RS(8'b11100000), .RSA(8'b11100001), .RE(8'b11100010), .REA(8'b11100011), .RW(8'b11100100), .HV(8'b11100101), .SSA(8'b11100110), .SSB(8'b11100111), .SNA(8'b11101000), .SNB(8'b11101010), .SNC(8'b11101011), .SND(8'b11101100), .SNE(8'b11101101), .SNF(8'b11101110), .IF(8'b11101111), .IG(8'b11110000), .SRD(8'b11110001), .SRC(8'b11110010), .SRB(8'b11110011), .SRA(8'b11110100), .GSA(8'b11110101), .NRD(8'b11110110), .NRC(8'b11110111), .NRB(8'b11111000), .NRA(8'b11111001), .GNA(8'b11111010), .SS(8'b11111011), .SN(8'b11111100), .SE(8'b11111101), .SW(8'b11111110), .ERROR(8'b11111111), .IPbtl(8), .IPbtr(6), .IPa(5), .IPs(4), .IPver(2), .IPsend(0), .IPrec(1)) inst26 (
    .clk(clock_block), .en(enable), .set(set), .SetIn(inst105_outtunnel), .inNorth(inst19_outsouth),
    .inSouth(inst33_outnorth), .inEast(inst27_outeast), .inWest(inst25_outwest), .outNorth(inst26_outnorth),
    .outSouth(inst26_outsouth), .outEast(inst26_outeast), .outWest(inst26_outwest), .dispOut(inst26_dispout));  // open: outState
  blockV2 #(.inL(8), .outL(8), .empty(3'b000), .tunnel(3'b111), .ground(3'b011), .air(3'b001), .dirt(3'b010), .queen(3'b100), .wall(3'b101), .errorblock(3'b110), .START(8'b00110011), .A(8'b00000000), .B(8'b00000001), .C(8'b00000010), .D(8'b00000011), .E(8'b00000100), .F(8'b00000101), .G(8'b00000110), .H(8'b00000111), .I(8'b00001000), .J(8'b00001001), .K(8'b00001010), .L(8'b00001011), .M(8'b00001100), .N(8'b00001101), .O(8'b00001110), .P(8'b00001111), .Q(8'b00010000), .R(8'b00010001), .S(8'b00010010), .T(8'b00010011), .U(8'b00010100), .V(8'b00010101), .W(8'b00010110), .X(8'b00010111), .Y(8'b00011000), .Z(8'b00011001), .AA(8'b00011010), .AB(8'b00011011), .AC(8'b00011100), .AD(8'b00011101), .AE(8'b00011110), .AF(8'b00011111), .AG(8'b00100000), .AH(8'b00100001), .AI(8'b00100010), .AJ(8'b00100011), .AK(8'b00100100), .AL(8'b00100101), .AM(8'b00100110), .AN(8'b00100111), .AO(8'b00101000), .AP(8'b00101001), .AQ(8'b00101010), .AR(8'b00101011), .AS(8'b00101100), .AT(8'b00101101), .AU(8'b00101110), .AV(8'b00101111), .AW(8'b00110000), .AX(8'b00110001), .AY(8'b00110010), .AZ(8'b00110011), .BA(8'b00110100), .BB(8'b00110101), .BC(8'b00110110), .BD(8'b00110111), .BE(8'b00111000), .BF(8'b00111001), .BG(8'b00111010), .BH(8'b00111011), .CW(8'b01100100), .CX(8'b01100101), .CY(8'b01100110), .DA(8'b01101000), .DB(8'b01101001), .DC(8'b01101010), .DD(8'b01101011), .DE(8'b01101100), .DF(8'b01101101), .DG(8'b01101110), .DH(8'b01101111), .DI(8'b01110000), .DJ(8'b01110001), .DK(8'b01110010), .DL(8'b01110011), .DM(8'b01110100), .DN(8'b01110101), .DO(8'b01110110), .DP(8'b01110111), .FREE(8'b10010110), .SEA(8'b10010111), .SEB(8'b10011000), .SEC(8'b10011001), .SED(8'b10011010), .SEE(8'b10011100), .SEF(8'b10011101), .SEG(8'b10011110), .FD(8'b10011111), .FREE2(8'b10100000), .SWA(8'b10100001), .SWB(8'b10100010), .SWC(8'b10100011), .SWD(8'b10100100), .SWE(8'b10100101), .SWF(8'b10100110), .SWG(8'b10100111), .FM(8'b10101000), .FN(8'b10101001), .SNG(8'b10101010), .SSE(8'b10101011), .RWA(8'b10101100), .WAIT(8'b10101101), .WAIT2(8'b10101110), .WAIT3(8'b10101111), .WAIT4(8'b10110000), .FV(8'b10110001), .FW(8'b10110010), .FX(8'b10110011), .FY(8'b10110100), .GA(8'b10110110), .GB(8'b10110111), .GC(8'b10111000), .GD(8'b10111001), .GE(8'b10111010), .GF(8'b10111011), .GG(8'b10111100), .GH(8'b10111101), .GI(8'b10111110), .GJ(8'b10111111), .GK(8'b11000000), .GL(8'b11000001), .GM(8'b11000010), .GN(8'b11000011), .GO(8'b11000100), .GP(8'b11000101), .GQ(8'b11000110), .GR(8'b11000111), .GS(8'b11001000), .GT(8'b11001001), .GU(8'b11001010), .GV(8'b11001011), .GW(8'b11001100), .GX(8'b11001101), .GY(8'b11001110), .HA(8'b11010000), .HB(8'b11010001), .SSC(8'b11010010), .SSD(8'b11010011), .SSF(8'b11010100), .SSG(8'b11010101), .HG(8'b11010110), .HH(8'b11010111), .HI(8'b11011000), .HJ(8'b11011001), .HK(8'b11011010), .HL(8'b11011011), .RA(8'b11011100), .RB(8'b11011101), .RN(8'b11011110), .RNA(8'b11011111), .RS(8'b11100000), .RSA(8'b11100001), .RE(8'b11100010), .REA(8'b11100011), .RW(8'b11100100), .HV(8'b11100101), .SSA(8'b11100110), .SSB(8'b11100111), .SNA(8'b11101000), .SNB(8'b11101010), .SNC(8'b11101011), .SND(8'b11101100), .SNE(8'b11101101), .SNF(8'b11101110), .IF(8'b11101111), .IG(8'b11110000), .SRD(8'b11110001), .SRC(8'b11110010), .SRB(8'b11110011), .SRA(8'b11110100), .GSA(8'b11110101), .NRD(8'b11110110), .NRC(8'b11110111), .NRB(8'b11111000), .NRA(8'b11111001), .GNA(8'b11111010), .SS(8'b11111011), .SN(8'b11111100), .SE(8'b11111101), .SW(8'b11111110), .ERROR(8'b11111111), .IPbtl(8), .IPbtr(6), .IPa(5), .IPs(4), .IPver(2), .IPsend(0), .IPrec(1)) inst33 (
    .clk(clock_block), .en(enable), .set(set), .SetIn(inst105_outtunnel), .inNorth(inst26_outsouth),
    .inSouth(inst37_outnorth), .inEast(inst34_outeast), .inWest(inst32_outwest), .outNorth(inst33_outnorth),
    .outSouth(inst33_outsouth), .outEast(inst33_outeast), .outWest(inst33_outwest), .dispOut(inst33_dispout));  // open: outState
  blockV2 #(.inL(8), .outL(8), .empty(3'b000), .tunnel(3'b111), .ground(3'b011), .air(3'b001), .dirt(3'b010), .queen(3'b100), .wall(3'b101), .errorblock(3'b110), .START(8'b00110011), .A(8'b00000000), .B(8'b00000001), .C(8'b00000010), .D(8'b00000011), .E(8'b00000100), .F(8'b00000101), .G(8'b00000110), .H(8'b00000111), .I(8'b00001000), .J(8'b00001001), .K(8'b00001010), .L(8'b00001011), .M(8'b00001100), .N(8'b00001101), .O(8'b00001110), .P(8'b00001111), .Q(8'b00010000), .R(8'b00010001), .S(8'b00010010), .T(8'b00010011), .U(8'b00010100), .V(8'b00010101), .W(8'b00010110), .X(8'b00010111), .Y(8'b00011000), .Z(8'b00011001), .AA(8'b00011010), .AB(8'b00011011), .AC(8'b00011100), .AD(8'b00011101), .AE(8'b00011110), .AF(8'b00011111), .AG(8'b00100000), .AH(8'b00100001), .AI(8'b00100010), .AJ(8'b00100011), .AK(8'b00100100), .AL(8'b00100101), .AM(8'b00100110), .AN(8'b00100111), .AO(8'b00101000), .AP(8'b00101001), .AQ(8'b00101010), .AR(8'b00101011), .AS(8'b00101100), .AT(8'b00101101), .AU(8'b00101110), .AV(8'b00101111), .AW(8'b00110000), .AX(8'b00110001), .AY(8'b00110010), .AZ(8'b00110011), .BA(8'b00110100), .BB(8'b00110101), .BC(8'b00110110), .BD(8'b00110111), .BE(8'b00111000), .BF(8'b00111001), .BG(8'b00111010), .BH(8'b00111011), .CW(8'b01100100), .CX(8'b01100101), .CY(8'b01100110), .DA(8'b01101000), .DB(8'b01101001), .DC(8'b01101010), .DD(8'b01101011), .DE(8'b01101100), .DF(8'b01101101), .DG(8'b01101110), .DH(8'b01101111), .DI(8'b01110000), .DJ(8'b01110001), .DK(8'b01110010), .DL(8'b01110011), .DM(8'b01110100), .DN(8'b01110101), .DO(8'b01110110), .DP(8'b01110111), .FREE(8'b10010110), .SEA(8'b10010111), .SEB(8'b10011000), .SEC(8'b10011001), .SED(8'b10011010), .SEE(8'b10011100), .SEF(8'b10011101), .SEG(8'b10011110), .FD(8'b10011111), .FREE2(8'b10100000), .SWA(8'b10100001), .SWB(8'b10100010), .SWC(8'b10100011), .SWD(8'b10100100), .SWE(8'b10100101), .SWF(8'b10100110), .SWG(8'b10100111), .FM(8'b10101000), .FN(8'b10101001), .SNG(8'b10101010), .SSE(8'b10101011), .RWA(8'b10101100), .WAIT(8'b10101101), .WAIT2(8'b10101110), .WAIT3(8'b10101111), .WAIT4(8'b10110000), .FV(8'b10110001), .FW(8'b10110010), .FX(8'b10110011), .FY(8'b10110100), .GA(8'b10110110), .GB(8'b10110111), .GC(8'b10111000), .GD(8'b10111001), .GE(8'b10111010), .GF(8'b10111011), .GG(8'b10111100), .GH(8'b10111101), .GI(8'b10111110), .GJ(8'b10111111), .GK(8'b11000000), .GL(8'b11000001), .GM(8'b11000010), .GN(8'b11000011), .GO(8'b11000100), .GP(8'b11000101), .GQ(8'b11000110), .GR(8'b11000111), .GS(8'b11001000), .GT(8'b11001001), .GU(8'b11001010), .GV(8'b11001011), .GW(8'b11001100), .GX(8'b11001101), .GY(8'b11001110), .HA(8'b11010000), .HB(8'b11010001), .SSC(8'b11010010), .SSD(8'b11010011), .SSF(8'b11010100), .SSG(8'b11010101), .HG(8'b11010110), .HH(8'b11010111), .HI(8'b11011000), .HJ(8'b11011001), .HK(8'b11011010), .HL(8'b11011011), .RA(8'b11011100), .RB(8'b11011101), .RN(8'b11011110), .RNA(8'b11011111), .RS(8'b11100000), .RSA(8'b11100001), .RE(8'b11100010), .REA(8'b11100011), .RW(8'b11100100), .HV(8'b11100101), .SSA(8'b11100110), .SSB(8'b11100111), .SNA(8'b11101000), .SNB(8'b11101010), .SNC(8'b11101011), .SND(8'b11101100), .SNE(8'b11101101), .SNF(8'b11101110), .IF(8'b11101111), .IG(8'b11110000), .SRD(8'b11110001), .SRC(8'b11110010), .SRB(8'b11110011), .SRA(8'b11110100), .GSA(8'b11110101), .NRD(8'b11110110), .NRC(8'b11110111), .NRB(8'b11111000), .NRA(8'b11111001), .GNA(8'b11111010), .SS(8'b11111011), .SN(8'b11111100), .SE(8'b11111101), .SW(8'b11111110), .ERROR(8'b11111111), .IPbtl(8), .IPbtr(6), .IPa(5), .IPs(4), .IPver(2), .IPsend(0), .IPrec(1)) inst37 (
    .clk(clock_block), .en(enable), .set(set), .SetIn(inst105_outant), .inNorth(inst33_outsouth),
    .inEast(inst38_outeast), .outNorth(inst37_outnorth), .outWest(inst37_outwest), .dispOut(inst37_dispout));  // open: inSouth, inWest, outSouth, outEast, outState
  blockV2 #(.inL(8), .outL(8), .empty(3'b000), .tunnel(3'b111), .ground(3'b011), .air(3'b001), .dirt(3'b010), .queen(3'b100), .wall(3'b101), .errorblock(3'b110), .START(8'b00110011), .A(8'b00000000), .B(8'b00000001), .C(8'b00000010), .D(8'b00000011), .E(8'b00000100), .F(8'b00000101), .G(8'b00000110), .H(8'b00000111), .I(8'b00001000), .J(8'b00001001), .K(8'b00001010), .L(8'b00001011), .M(8'b00001100), .N(8'b00001101), .O(8'b00001110), .P(8'b00001111), .Q(8'b00010000), .R(8'b00010001), .S(8'b00010010), .T(8'b00010011), .U(8'b00010100), .V(8'b00010101), .W(8'b00010110), .X(8'b00010111), .Y(8'b00011000), .Z(8'b00011001), .AA(8'b00011010), .AB(8'b00011011), .AC(8'b00011100), .AD(8'b00011101), .AE(8'b00011110), .AF(8'b00011111), .AG(8'b00100000), .AH(8'b00100001), .AI(8'b00100010), .AJ(8'b00100011), .AK(8'b00100100), .AL(8'b00100101), .AM(8'b00100110), .AN(8'b00100111), .AO(8'b00101000), .AP(8'b00101001), .AQ(8'b00101010), .AR(8'b00101011), .AS(8'b00101100), .AT(8'b00101101), .AU(8'b00101110), .AV(8'b00101111), .AW(8'b00110000), .AX(8'b00110001), .AY(8'b00110010), .AZ(8'b00110011), .BA(8'b00110100), .BB(8'b00110101), .BC(8'b00110110), .BD(8'b00110111), .BE(8'b00111000), .BF(8'b00111001), .BG(8'b00111010), .BH(8'b00111011), .CW(8'b01100100), .CX(8'b01100101), .CY(8'b01100110), .DA(8'b01101000), .DB(8'b01101001), .DC(8'b01101010), .DD(8'b01101011), .DE(8'b01101100), .DF(8'b01101101), .DG(8'b01101110), .DH(8'b01101111), .DI(8'b01110000), .DJ(8'b01110001), .DK(8'b01110010), .DL(8'b01110011), .DM(8'b01110100), .DN(8'b01110101), .DO(8'b01110110), .DP(8'b01110111), .FREE(8'b10010110), .SEA(8'b10010111), .SEB(8'b10011000), .SEC(8'b10011001), .SED(8'b10011010), .SEE(8'b10011100), .SEF(8'b10011101), .SEG(8'b10011110), .FD(8'b10011111), .FREE2(8'b10100000), .SWA(8'b10100001), .SWB(8'b10100010), .SWC(8'b10100011), .SWD(8'b10100100), .SWE(8'b10100101), .SWF(8'b10100110), .SWG(8'b10100111), .FM(8'b10101000), .FN(8'b10101001), .SNG(8'b10101010), .SSE(8'b10101011), .RWA(8'b10101100), .WAIT(8'b10101101), .WAIT2(8'b10101110), .WAIT3(8'b10101111), .WAIT4(8'b10110000), .FV(8'b10110001), .FW(8'b10110010), .FX(8'b10110011), .FY(8'b10110100), .GA(8'b10110110), .GB(8'b10110111), .GC(8'b10111000), .GD(8'b10111001), .GE(8'b10111010), .GF(8'b10111011), .GG(8'b10111100), .GH(8'b10111101), .GI(8'b10111110), .GJ(8'b10111111), .GK(8'b11000000), .GL(8'b11000001), .GM(8'b11000010), .GN(8'b11000011), .GO(8'b11000100), .GP(8'b11000101), .GQ(8'b11000110), .GR(8'b11000111), .GS(8'b11001000), .GT(8'b11001001), .GU(8'b11001010), .GV(8'b11001011), .GW(8'b11001100), .GX(8'b11001101), .GY(8'b11001110), .HA(8'b11010000), .HB(8'b11010001), .SSC(8'b11010010), .SSD(8'b11010011), .SSF(8'b11010100), .SSG(8'b11010101), .HG(8'b11010110), .HH(8'b11010111), .HI(8'b11011000), .HJ(8'b11011001), .HK(8'b11011010), .HL(8'b11011011), .RA(8'b11011100), .RB(8'b11011101), .RN(8'b11011110), .RNA(8'b11011111), .RS(8'b11100000), .RSA(8'b11100001), .RE(8'b11100010), .REA(8'b11100011), .RW(8'b11100100), .HV(8'b11100101), .SSA(8'b11100110), .SSB(8'b11100111), .SNA(8'b11101000), .SNB(8'b11101010), .SNC(8'b11101011), .SND(8'b11101100), .SNE(8'b11101101), .SNF(8'b11101110), .IF(8'b11101111), .IG(8'b11110000), .SRD(8'b11110001), .SRC(8'b11110010), .SRB(8'b11110011), .SRA(8'b11110100), .GSA(8'b11110101), .NRD(8'b11110110), .NRC(8'b11110111), .NRB(8'b11111000), .NRA(8'b11111001), .GNA(8'b11111010), .SS(8'b11111011), .SN(8'b11111100), .SE(8'b11111101), .SW(8'b11111110), .ERROR(8'b11111111), .IPbtl(8), .IPbtr(6), .IPa(5), .IPs(4), .IPver(2), .IPsend(0), .IPrec(1)) inst6 (
    .clk(clock_block), .en(enable), .set(set), .SetIn(inst105_outsugar), .inNorth(inst38_outsouth),
    .inSouth(inst13_outnorth), .inEast(inst7_outeast), .inWest(inst5_outwest), .outNorth(inst6_outnorth),
    .outSouth(inst6_outsouth), .outEast(inst6_outeast), .outWest(inst6_outwest), .dispOut(inst6_dispout));  // open: outState
